# EAGLE design X13_Power_Distribution_D (EAGLE 9.6.2)
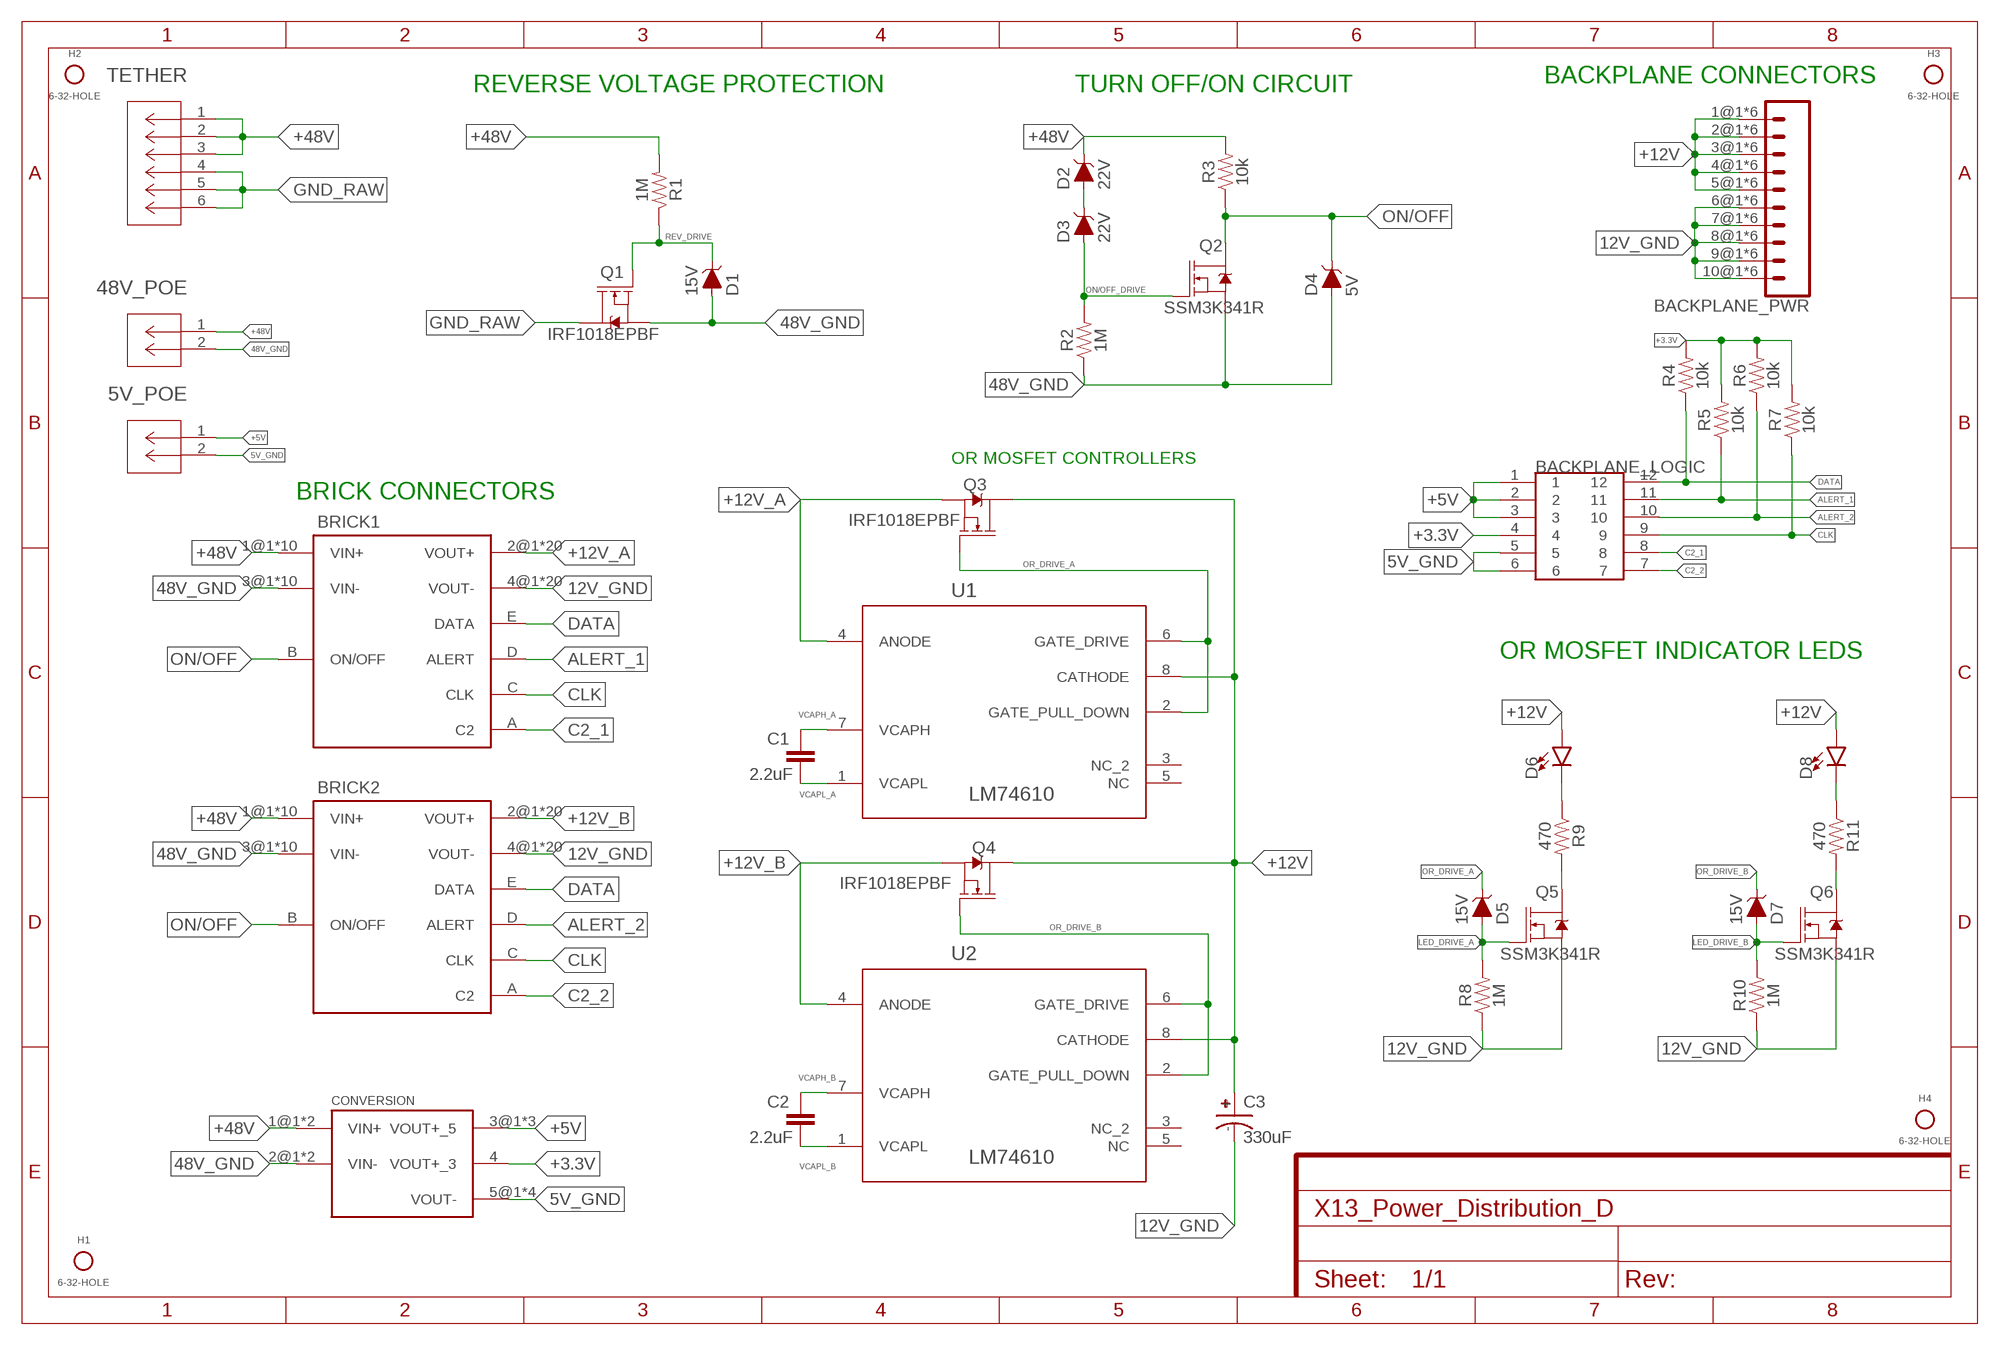
[diagram p0: schematic, sheet 1, part 1 of 2]
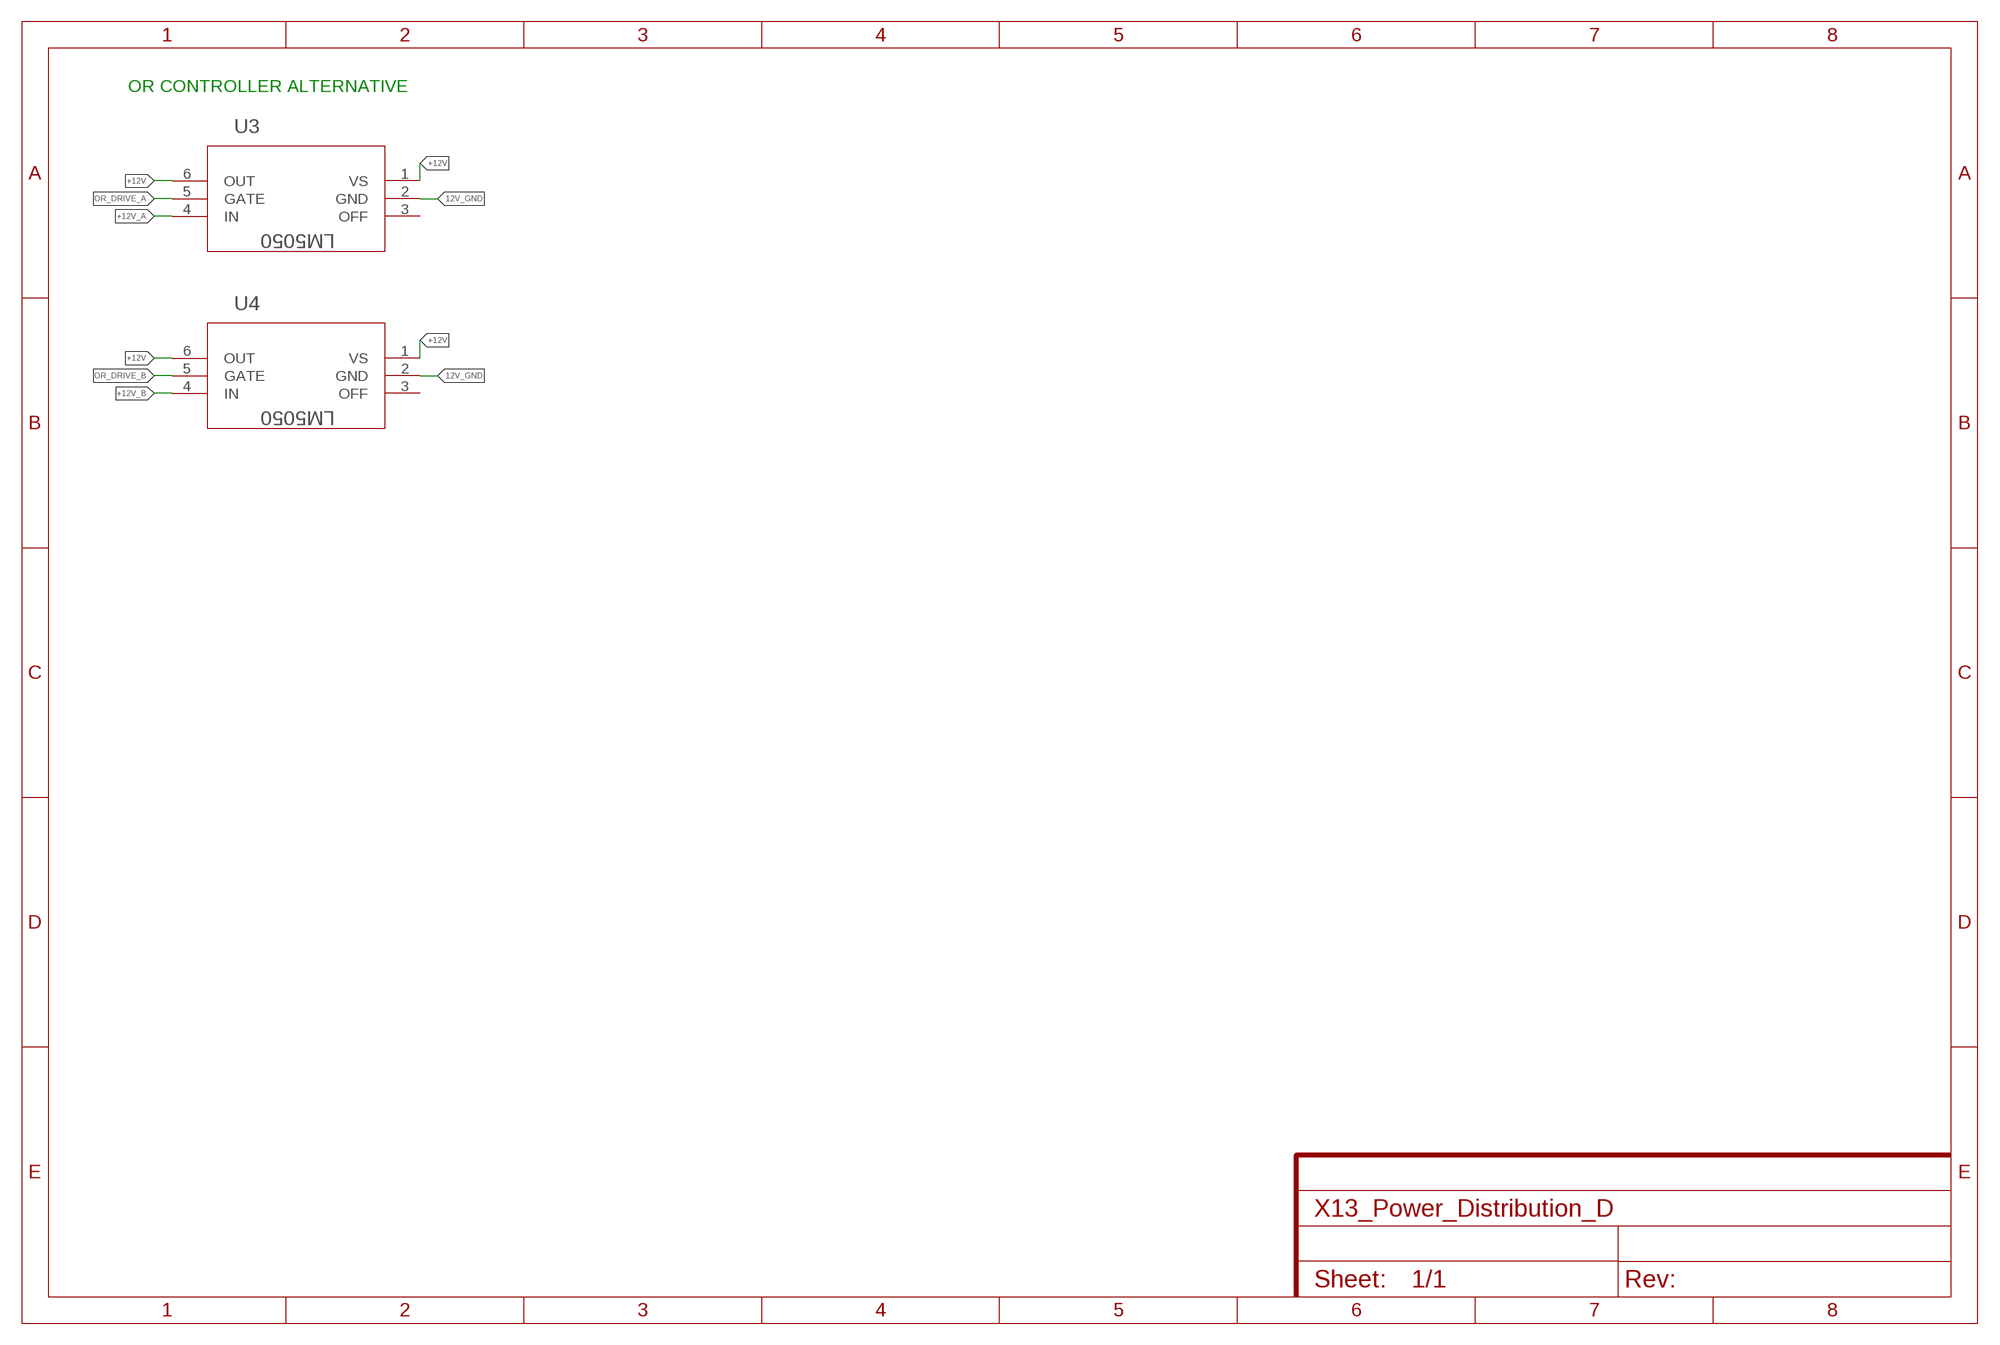
[diagram p1: schematic, sheet 1, part 2 of 2]

## Parts
5V_POE  POE_TERMINAL  [CONN2_282834-2_TEC]
48V_POE  POE_TERMINAL  [CONN2_282834-2_TEC]
BACKPLANE_LOGIC  IPL1-106-01-L-D-K  [IPL1-106-01-L-D-K]
BACKPLANE_PWR  MPPT-10-01-01-L-RA-SD  [MPPT-10-01-01-L-RA-SD]
BRICK1  DIST2BRICKVER_D2  [DIST2BRICK_D2]
BRICK2  DIST2BRICKVER_D2  [DIST2BRICK_D2]
C1  2.2uF  0.1UF-0603-100V-10%  [0603]
C2  2.2uF  0.1UF-0603-100V-10%  [0603]
C3  330uF  UCM1H331MNL1GS  [CAPAE1030X1050N]
CONVERSION  DIST2CON  [DIST2CON]
D1  15V  DIODE-ZENER-BZT52C3V6S  [SOD-323]
D2  22V  DIODE-ZENER-BZT52C3V6S  [SOD-323]
D3  22V  DIODE-ZENER-BZT52C3V6S  [SOD-323]
D4  5V  DIODE-ZENER-BZT52C3V6S  [SOD-323]
D5  15V  DIODE-ZENER-BZT52C3V6S  [SOD-323]
D6  LED0603  [LED-0603]
D7  15V  DIODE-ZENER-BZT52C3V6S  [SOD-323]
D8  LED0603  [LED-0603]
H1  6-32-HOLE  [6-32-HOLE]
H2  6-32-HOLE  [6-32-HOLE]
H3  6-32-HOLE  [6-32-HOLE]
H4  6-32-HOLE  [6-32-HOLE]
Q1  IRF1018EPBF  [TO263]
Q2  SSM3K341R  MOSFET-NCH-2N7002PW  [SOT323]
Q3  IRF1018EPBF  [TO263]
Q4  IRF1018EPBF  [TO263]
Q5  SSM3K341R  MOSFET-NCH-2N7002PW  [SOT323]
Q6  SSM3K341R  MOSFET-NCH-2N7002PW  [SOT323]
R1  1M  RESISTOR0603  [0603]
R2  1M  RESISTOR0603  [0603]
R3  10k  RESISTOR0603  [0603]
R4  10k  RESISTOR0603  [0603]
R5  10k  RESISTOR0603  [0603]
R6  10k  RESISTOR0603  [0603]
R7  10k  RESISTOR0603  [0603]
R8  1M  RESISTOR0603  [0603]
R9  470  RESISTOR0603  [0603]
R10  1M  RESISTOR0603  [0603]
R11  470  RESISTOR0603  [0603]
TETHER  48V  DIST_TO_TETHER  [CON6_P5MM_VER_TERM-BLK_TYC]
U1  LM74610  DIST_OR_DIODEDGK0008A_M  [DGK0008A_M]
U2  LM74610  DIST_OR_DIODEDGK0008A_M  [DGK0008A_M]
U3  LM5050  DIST_OR_CONTROL_ALTMK06A-M  [MK06A-M]
U4  LM5050  DIST_OR_CONTROL_ALTMK06A-M  [MK06A-M]

## Nets
5V_GND: 5V_POE.2 BACKPLANE_LOGIC.5 BACKPLANE_LOGIC.6 CONVERSION.5@1(VOUT-) CONVERSION.5@2(VOUT-) CONVERSION.5@3(VOUT-) CONVERSION.5@4(VOUT-)
12V_GND: BACKPLANE_PWR.6@1 BACKPLANE_PWR.6@2 BACKPLANE_PWR.6@3 BACKPLANE_PWR.6@4 BACKPLANE_PWR.6@5 BACKPLANE_PWR.6@6 BACKPLANE_PWR.7@1 BACKPLANE_PWR.7@2 BACKPLANE_PWR.7@3 BACKPLANE_PWR.7@4 BACKPLANE_PWR.7@5 BACKPLANE_PWR.7@6 BACKPLANE_PWR.8@1 BACKPLANE_PWR.8@2 BACKPLANE_PWR.8@3 BACKPLANE_PWR.8@4 BACKPLANE_PWR.8@5 BACKPLANE_PWR.8@6 BACKPLANE_PWR.9@1 BACKPLANE_PWR.9@2 BACKPLANE_PWR.9@3 BACKPLANE_PWR.9@4 BACKPLANE_PWR.9@5 BACKPLANE_PWR.9@6 BACKPLANE_PWR.10@1 BACKPLANE_PWR.10@2 BACKPLANE_PWR.10@3 BACKPLANE_PWR.10@4 BACKPLANE_PWR.10@5 BACKPLANE_PWR.10@6 BRICK1.4@1(VOUT-) BRICK1.4@2(VOUT-) BRICK1.4@3(VOUT-) BRICK1.4@4(VOUT-) BRICK1.4@5(VOUT-) BRICK1.4@6(VOUT-) BRICK1.4@7(VOUT-) BRICK1.4@8(VOUT-) BRICK1.4@9(VOUT-) BRICK1.4@10(VOUT-) BRICK1.4@11(VOUT-) BRICK1.4@12(VOUT-) BRICK1.4@13(VOUT-) BRICK1.4@14(VOUT-) BRICK1.4@15(VOUT-) BRICK1.4@16(VOUT-) BRICK1.4@17(VOUT-) BRICK1.4@18(VOUT-) BRICK1.4@19(VOUT-) BRICK1.4@20(VOUT-) BRICK2.4@1(VOUT-) BRICK2.4@2(VOUT-) BRICK2.4@3(VOUT-) BRICK2.4@4(VOUT-) BRICK2.4@5(VOUT-) BRICK2.4@6(VOUT-) BRICK2.4@7(VOUT-) BRICK2.4@8(VOUT-) BRICK2.4@9(VOUT-) BRICK2.4@10(VOUT-) BRICK2.4@11(VOUT-) BRICK2.4@12(VOUT-) BRICK2.4@13(VOUT-) BRICK2.4@14(VOUT-) BRICK2.4@15(VOUT-) BRICK2.4@16(VOUT-) BRICK2.4@17(VOUT-) BRICK2.4@18(VOUT-) BRICK2.4@19(VOUT-) BRICK2.4@20(VOUT-) C3.- Q5.2(S) Q6.2(S) R8.1 R10.1 U3.2(GND) U4.2(GND)
48V_GND: 48V_POE.2 BRICK1.3@1(VIN-) BRICK1.3@2(VIN-) BRICK1.3@3(VIN-) BRICK1.3@4(VIN-) BRICK1.3@5(VIN-) BRICK1.3@6(VIN-) BRICK1.3@7(VIN-) BRICK1.3@8(VIN-) BRICK1.3@9(VIN-) BRICK1.3@10(VIN-) BRICK2.3@1(VIN-) BRICK2.3@2(VIN-) BRICK2.3@3(VIN-) BRICK2.3@4(VIN-) BRICK2.3@5(VIN-) BRICK2.3@6(VIN-) BRICK2.3@7(VIN-) BRICK2.3@8(VIN-) BRICK2.3@9(VIN-) BRICK2.3@10(VIN-) CONVERSION.2@1(VIN-) CONVERSION.2@2(VIN-) D1.A D4.A Q1.2(S) Q2.2(S) R2.1
+3.3V: BACKPLANE_LOGIC.4 CONVERSION.4(VOUT+_3) R4.2 R5.2 R6.2 R7.2
+5V: 5V_POE.1 BACKPLANE_LOGIC.1 BACKPLANE_LOGIC.2 BACKPLANE_LOGIC.3 CONVERSION.3@1(VOUT+_5) CONVERSION.3@2(VOUT+_5) CONVERSION.3@3(VOUT+_5)
+12V: BACKPLANE_PWR.1@1 BACKPLANE_PWR.1@2 BACKPLANE_PWR.1@3 BACKPLANE_PWR.1@4 BACKPLANE_PWR.1@5 BACKPLANE_PWR.1@6 BACKPLANE_PWR.2@1 BACKPLANE_PWR.2@2 BACKPLANE_PWR.2@3 BACKPLANE_PWR.2@4 BACKPLANE_PWR.2@5 BACKPLANE_PWR.2@6 BACKPLANE_PWR.3@1 BACKPLANE_PWR.3@2 BACKPLANE_PWR.3@3 BACKPLANE_PWR.3@4 BACKPLANE_PWR.3@5 BACKPLANE_PWR.3@6 BACKPLANE_PWR.4@1 BACKPLANE_PWR.4@2 BACKPLANE_PWR.4@3 BACKPLANE_PWR.4@4 BACKPLANE_PWR.4@5 BACKPLANE_PWR.4@6 BACKPLANE_PWR.5@1 BACKPLANE_PWR.5@2 BACKPLANE_PWR.5@3 BACKPLANE_PWR.5@4 BACKPLANE_PWR.5@5 BACKPLANE_PWR.5@6 C3.+ D6.A D8.A Q3.3(D) Q4.3(D) U1.8(CATHODE) U2.8(CATHODE) U3.1(VS) U3.6(OUT) U4.1(VS) U4.6(OUT)
+12V_A: BRICK1.2@1(VOUT+) BRICK1.2@2(VOUT+) BRICK1.2@3(VOUT+) BRICK1.2@4(VOUT+) BRICK1.2@5(VOUT+) BRICK1.2@6(VOUT+) BRICK1.2@7(VOUT+) BRICK1.2@8(VOUT+) BRICK1.2@9(VOUT+) BRICK1.2@10(VOUT+) BRICK1.2@11(VOUT+) BRICK1.2@12(VOUT+) BRICK1.2@13(VOUT+) BRICK1.2@14(VOUT+) BRICK1.2@15(VOUT+) BRICK1.2@16(VOUT+) BRICK1.2@17(VOUT+) BRICK1.2@18(VOUT+) BRICK1.2@19(VOUT+) BRICK1.2@20(VOUT+) Q3.2(S) U1.4(ANODE) U3.4(IN)
+12V_B: BRICK2.2@1(VOUT+) BRICK2.2@2(VOUT+) BRICK2.2@3(VOUT+) BRICK2.2@4(VOUT+) BRICK2.2@5(VOUT+) BRICK2.2@6(VOUT+) BRICK2.2@7(VOUT+) BRICK2.2@8(VOUT+) BRICK2.2@9(VOUT+) BRICK2.2@10(VOUT+) BRICK2.2@11(VOUT+) BRICK2.2@12(VOUT+) BRICK2.2@13(VOUT+) BRICK2.2@14(VOUT+) BRICK2.2@15(VOUT+) BRICK2.2@16(VOUT+) BRICK2.2@17(VOUT+) BRICK2.2@18(VOUT+) BRICK2.2@19(VOUT+) BRICK2.2@20(VOUT+) Q4.2(S) U2.4(ANODE) U4.4(IN)
+48V: 48V_POE.1 BRICK1.1@1(VIN+) BRICK1.1@2(VIN+) BRICK1.1@3(VIN+) BRICK1.1@4(VIN+) BRICK1.1@5(VIN+) BRICK1.1@6(VIN+) BRICK1.1@7(VIN+) BRICK1.1@8(VIN+) BRICK1.1@9(VIN+) BRICK1.1@10(VIN+) BRICK2.1@1(VIN+) BRICK2.1@2(VIN+) BRICK2.1@3(VIN+) BRICK2.1@4(VIN+) BRICK2.1@5(VIN+) BRICK2.1@6(VIN+) BRICK2.1@7(VIN+) BRICK2.1@8(VIN+) BRICK2.1@9(VIN+) BRICK2.1@10(VIN+) CONVERSION.1@1(VIN+) CONVERSION.1@2(VIN+) D2.C R1.2 R3.2 TETHER.1 TETHER.2 TETHER.3
ALERT_1: BACKPLANE_LOGIC.11 BRICK1.D(ALERT) R5.1
ALERT_2: BACKPLANE_LOGIC.10 BRICK2.D(ALERT) R6.1
C2_1: BACKPLANE_LOGIC.8 BRICK1.A(C2)
C2_2: BACKPLANE_LOGIC.7 BRICK2.A(C2)
CLK: BACKPLANE_LOGIC.9 BRICK1.C(CLK) BRICK2.C(CLK) R7.1
DATA: BACKPLANE_LOGIC.12 BRICK1.E(DATA) BRICK2.E(DATA) R4.1
GND_RAW: Q1.3(D) TETHER.4 TETHER.5 TETHER.6
LED_DRIVE_A: D5.A Q5.1(G) R8.2
LED_DRIVE_B: D7.A Q6.1(G) R10.2
N$1: D2.A D3.C
N$4: Q5.3(D) R9.2
N$5: D6.C R9.1
N$6: Q6.3(D) R11.2
N$7: D8.C R11.1
ON/OFF: BRICK1.B(ON/OFF) BRICK2.B(ON/OFF) D4.C Q2.3(D) R3.1
ON/OFF_DRIVE: D3.A Q2.1(G) R2.2
OR_DRIVE_A: D5.C Q3.1(G) U1.2(GATE_PULL_DOWN) U1.6(GATE_DRIVE) U3.5(GATE)
OR_DRIVE_B: D7.C Q4.1(G) U2.2(GATE_PULL_DOWN) U2.6(GATE_DRIVE) U4.5(GATE)
REV_DRIVE: D1.C Q1.1(G) R1.1
VCAPH_A: C1.1 U1.7(VCAPH)
VCAPH_B: C2.1 U2.7(VCAPH)
VCAPL_A: C1.2 U1.1(VCAPL)
VCAPL_B: C2.2 U2.1(VCAPL)
Unconnected: U1.3(NC_2) U1.5(NC) U2.3(NC_2) U2.5(NC) U3.3(OFF) U4.3(OFF)

## Notes on the sheet
- BACKPLANE CONNECTORS
- REVERSE VOLTAGE PROTECTION | TURN OFF/ON CIRCUIT | OR CONTROLLER ALTERNATIVE
- OR MOSFET CONTROLLERS
- BRICK CONNECTORS
- OR MOSFET INDICATOR LEDS

## Library data of the parts
5V_POE 48V_POE = Dist_POE:POE_TERMINAL; BUILT_BY: EMA_UL_Team; COPYRIGHT: Copyright (C) 2016 Accelerated Designs. All rights reserved; DESCRIPTION: TERMI-BLOK PCB MOUNT, 90 2P.; MANUFACTURER_PART_NUMBER: 282834-2; PITCH_MM_: 2.54; POSITIONS: 2; PRODUCT: Terminal Block Headers & Receptacles; ROWS-CONFIG: 1; SOURCELIBRARY: TE_Connectivity-2018-03-16; TE_PART_NUMBER: 282834-2; TYPE: Receptacle; VENDOR: TE Connectivity
BACKPLANE_LOGIC = Backplane_Dist_Logic_Connector:IPL1-106-01-L-D-K
BACKPLANE_PWR = Samtec MPPT Hermaphoditic 10 pos - MPPT-10-01-01-L-RA-SD:MPPT-10-01-01-L-RA-SD: Samtec MPPT Connector Right Angle Vertically mating Non-gendered https://www.samtec.com/products/mppt-10-01-01-l-ra-sd
BRICK1 BRICK2 = Brick_Dist_Connector:DIST2BRICK
C1 C2 = SparkFun-Capacitors:0.1UF: 0.1µF ceramic capacitors A capacitor is a passive two-terminal electrical component used to store electrical energy temporarily in an electric field.; PROD_ID: CAP-08390; VALUE: 0.1uF
C3 = brick-capacitor-UCM1H331MNL1GS:UCM1H331MNL1GS: Nichicon 330uF 50 V Aluminium Electrolytic Capacitor SMD, CM Series 2000h 10 (Dia.) x 10mm Source: Datasheet <http://www.nichicon.co.jp/english/products/pdfs/e-ucm.pdf>; ARROW_PART_NUMBER: UCM1H331MNL1GS; ARROW_PRICE-STOCK: https://www.arrow.com/en/products/ucm1h331mnl1gs/nichicon; DESCRIPTION: Nichicon 330uF 50 V Aluminium Electrolytic Capacitor SMD, CM Series 2000h 10 (Dia.) x 10mm; HEIGHT: 10.5mm; MANUFACTURER_NAME: Nichicon; MANUFACTURER_PART_NUMBER: UCM1H331MNL1GS; MOUSER_PART_NUMBER: 647-UCM1H331MNL1GS; MOUSER_PRICE-STOCK: https://www.mouser.co.uk/ProductDetail/Nichicon/UCM1H331MNL1GS?qs=DSgADHjnLTkTovFLdbC%252BNg%3D%3D
CONVERSION = Dist_Convert_Connector:DIST2CON
D1-D5 D7 = SparkFun-DiscreteSemi:DIODE-ZENER: Zener Diode A Zener diode allows current to flow from its anode to its cathode like a normal semiconductor diode, but it also permits current to flow in the reverse direction when its "Zener voltage" is reached. - WIkipedia; PROD_ID: DIO-08199; VALUE: 3.6V
D6 D8 = SparkFun-LED:LED: LED (Generic) Standard schematic elements and footprints for 5mm, 3mm, 1206, and 0603 sized LEDs. Generic LEDs with no color specified.
H1-H4 = Mounting Holes:6-32-HOLE
Q1 Q3 Q4 = Reverse_Voltage_NMOS:IRF1018EPBF
Q2 Q5 Q6 = SparkFun-DiscreteSemi:MOSFET-NCH: N-channel MOSFETs Voltage controlled devices that allow control of high current outputs. SparkFun Products: SparkFun OpenScale <https://www.sparkfun.com/products/13261> SparkFun Digital Sandbox <https://www.sparkfun.com/products/12651> SparkFun Monster Moto Shield <https://www.sparkfun.com/products/10182> SparkFun MOSFET Power Controller <https://www.sparkfun.com/products/11214>; PROD_ID: TRANS-11151; VALUE: 310mA/60V/1.6Ω
R1 R4-R7 R9 R11 = SparkFun-Resistors:RESISTOR: Generic Resistor Package
R2 R3 R8 R10 = SparkFun-Resistors:RESISTOR: Generic Resistor Package; SPICEPREFIX: R
TETHER = Dist_To_Tether_Connector:DIST_TO_TETHER; BUILT_BY: EMA_UL_Team; MANUFACTURER_PART_NUMBER: 796636-6; SOURCELIBRARY: Tyco_2012-04-26; VENDOR: TE Connectivity
U1 U2 = Dist_OR_Controller:DIST_OR_DIODE; APPLICATION_BUILDNUMBER: *; COMPTYPE: IC; MANUFACTURER: Texas Instruments; MOUNTTYPE: SMT; PACKAGEREFERENCE: DGK0008A; PARTNUMBER: LM74610QDGKRQ1; PIN_COUNT: 8; REFDES: RefDes; TYPE: TYPE; VALUE: Value
U3 U4 = Dist_OR_Controller:DIST_OR_CONTROL_ALT; BASEPN: LM5050-1; DATASHEETURL: http://www.ti.com/lit/ds/symlink/lm5050-1.pdf; DESCRIPTION: High Side OR-ing FET Controller; MANUFACTURER: Texas Instruments; MANUFACTURER_PART_NUMBER: LM5050MK-1/NOPB; NSC_PACKAGEREFERENCE: MK06A; VENDOR: Texas Instruments

## Net classes
0 default: width 0.203 mm, clearance 0.205 mm

## Board
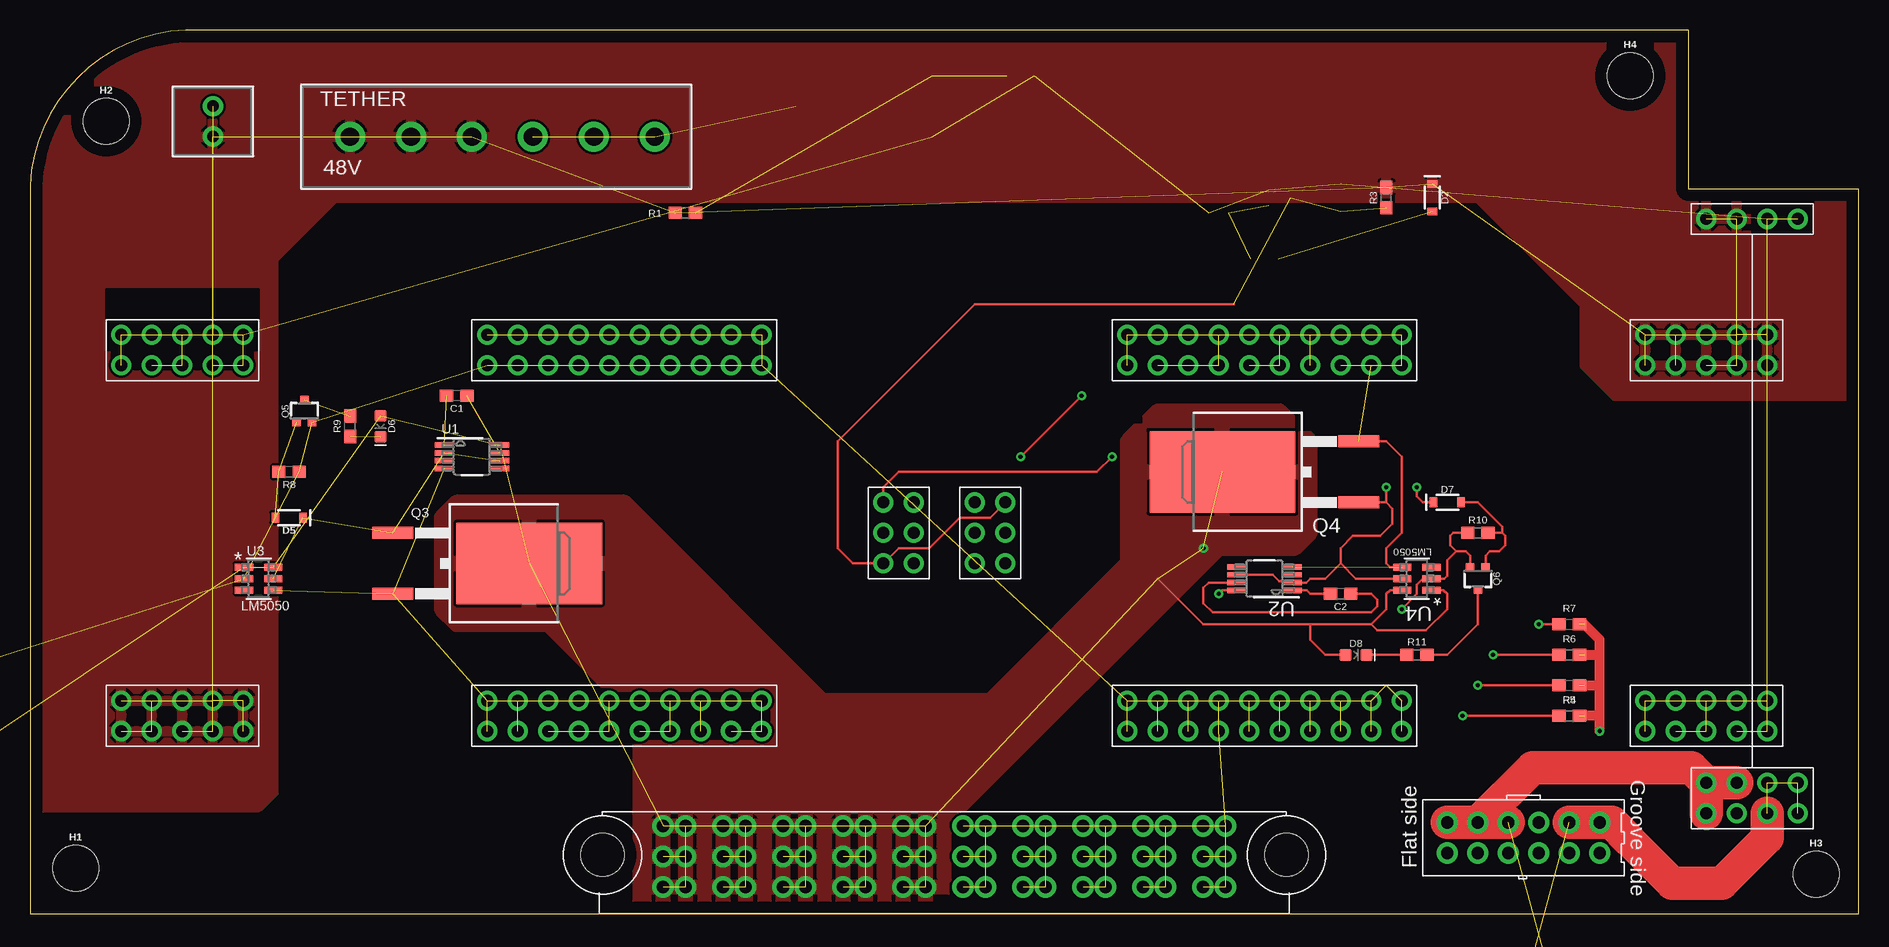
[diagram p2: board, top side]
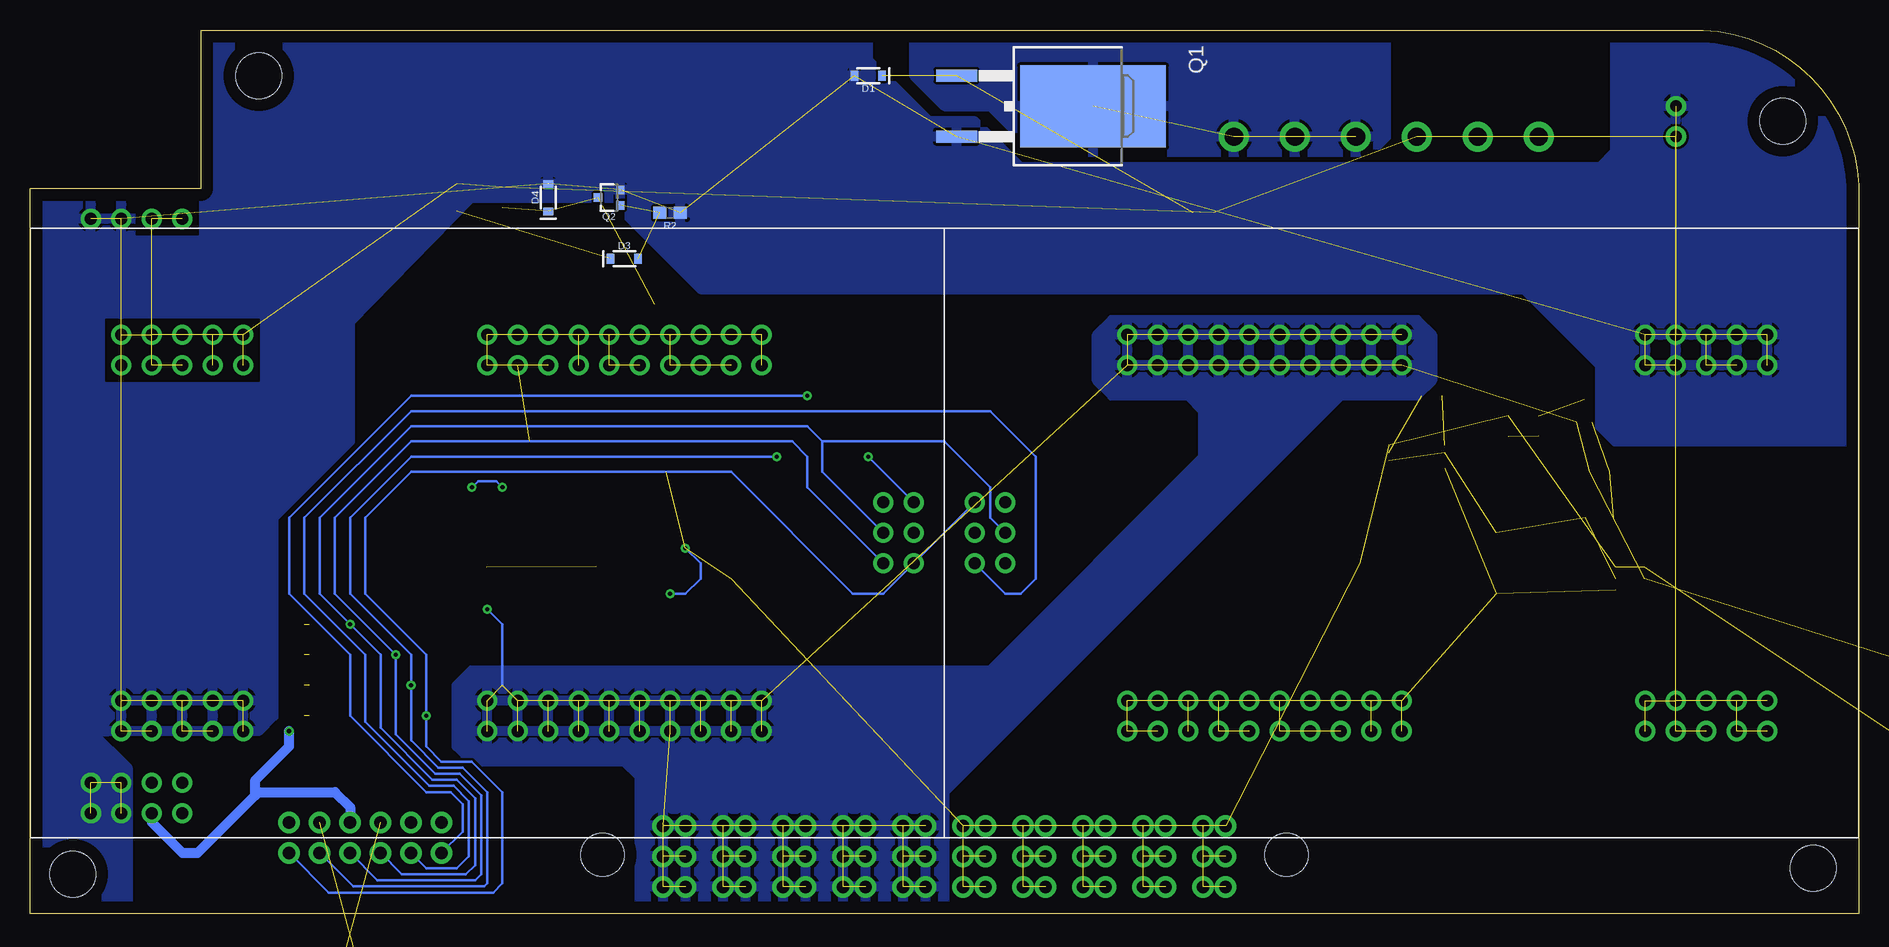
[diagram p3: board, bottom side, seen from below]

Size 152.4 x 73.66 mm. Coordinates in mm from the lower left corner, seen from the top.
Outline: 0,0 152.4,0 152.4,60.45 138.18,60.45 138.18,73.66 14.22,73.66 arc90 0,60.71 0,0
Copper layers (1*16): Top 0.035mm / dielectric 1.5mm / Bottom 0.035mm
Design rules "default": minimum track width 6mil, minimum drill 0.35mm, track to track 6mil, track to pad 6mil, pad to pad 6mil, via to via 6mil, smd to smd 6mil, copper to edge 40mil, drill to drill 6mil, minimum pad ring 10mil, minimum via ring 8mil, stop-mask expansion 4mil, vias tented up to drill 0mil, thermal gap 10mil

### Footprints (pad centres in the part's own frame; a part is rotated, then mirrored left to right if it is on the bottom)
CONN2_282834-2_TEC = drill 0.965 pad 1.7: 1 0,0; 2 2.54,0
IPL1-106-01-L-D-K = drill 1.016 pad 1.778: 1 0,0; 2 2.54,0; 3 5.08,0; 4 7.62,0; 5 10.16,0; 6 12.7,0; 7 0,-2.54; 8 2.54,-2.54; 9 5.08,-2.54; 10 7.62,-2.54; 11 10.16,-2.54; 12 12.7,-2.54
MPPT-10-01-01-L-RA-SD = drill 1.04 pad 1.8: 1@1 -23.44,2.26; 1@2 -21.56,2.26; 1@3 -23.44,4.8; 1@4 -21.56,4.8; 1@5 -23.44,7.34; 1@6 -21.56,7.34; 2@1 -18.44,2.26; 2@2 -16.56,2.26; 2@3 -18.44,4.8; 2@4 -16.56,4.8; 2@5 -18.44,7.34; 2@6 -16.56,7.34; 3@1 -13.44,2.26; 3@2 -11.56,2.26; 3@3 -13.44,4.8; 3@4 -11.56,4.8; 3@5 -13.44,7.34; 3@6 -11.56,7.34; 4@1 -8.44,2.26; 4@2 -6.56,2.26; 4@3 -8.44,4.8; 4@4 -6.56,4.8; 4@5 -8.44,7.34; 4@6 -6.56,7.34; 5@1 -3.44,2.26; 5@2 -1.56,2.26; 5@3 -3.44,4.8; 5@4 -1.56,4.8; 5@5 -3.44,7.34; 5@6 -1.56,7.34; 6@1 1.56,2.26; 6@2 3.44,2.26; 6@3 1.56,4.8; 6@4 3.44,4.8; 6@5 1.56,7.34; 6@6 3.44,7.34; 7@1 6.56,2.26; 7@2 8.44,2.26; 7@3 6.56,4.8; 7@4 8.44,4.8; 7@5 6.56,7.34; 7@6 8.44,7.34; 8@1 11.56,2.26; 8@2 13.44,2.26; 8@3 11.56,4.8; 8@4 13.44,4.8; 8@5 11.56,7.34; 8@6 13.44,7.34; 9@1 16.56,2.26; 9@2 18.44,2.26; 9@3 16.56,4.8; 9@4 18.44,4.8; 9@5 16.56,7.34; 9@6 18.44,7.34; 10@1 21.56,2.26; 10@2 23.44,2.26; 10@3 21.56,4.8; 10@4 23.44,4.8; 10@5 21.56,7.34; 10@6 23.44,7.34 | hole 3.6: 28.5,4.93; -28.5,4.93
DIST2BRICK_D2 = drill 1 pad 1.676: 1@1 -30.48,-16.51; 1@2 -30.48,-13.97; 1@3 -27.94,-16.51; 1@4 -27.94,-13.97; 1@5 -25.4,-16.51; 1@6 -25.4,-13.97; 1@7 -22.86,-16.51; 1@8 -22.86,-13.97; 1@9 -20.32,-16.51; 1@10 -20.32,-13.97; 2@1 0,-16.51; 2@2 0,-13.97; 2@3 2.54,-16.51; 2@4 2.54,-13.97; 2@5 5.08,-16.51; 2@6 5.08,-13.97; 2@7 7.62,-16.51; 2@8 7.62,-13.97; 2@9 10.16,-16.51; 2@10 10.16,-13.97; 2@11 12.7,-16.51; 2@12 12.7,-13.97; 2@13 15.24,-16.51; 2@14 15.24,-13.97; 2@15 17.78,-16.51; 2@16 17.78,-13.97; 2@17 20.32,-13.97; 2@18 22.86,-13.97; 2@19 22.86,-16.51; 2@20 20.32,-16.51; 3@1 -30.48,13.97; 3@2 -30.48,16.51; 3@3 -27.94,13.97; 3@4 -27.94,16.51; 3@5 -25.4,13.97; 3@6 -25.4,16.51; 3@7 -22.86,13.97; 3@8 -22.86,16.51; 3@9 -20.32,13.97; 3@10 -20.32,16.51; 4@1 0,13.97; 4@2 0,16.51; 4@3 2.54,13.97; 4@4 2.54,16.51; 4@5 5.08,13.97; 4@6 5.08,16.51; 4@7 7.62,13.97; 4@8 7.62,16.51; 4@9 10.16,13.97; 4@10 10.16,16.51; 4@11 12.7,13.97; 4@12 12.7,16.51; 4@13 15.24,13.97; 4@14 15.24,16.51; 4@15 17.78,13.97; 4@16 17.78,16.51; 4@17 20.32,16.51; 4@18 22.86,16.51; 4@19 22.86,13.97; 4@20 20.32,13.97; A 35.56,-2.54; B 33.02,-2.54; C 33.02,0; D 33.02,2.54; E 35.56,2.54; F 35.56,0
0603 = smd 1.1 x 1: 1 -0.85,0; 2 0.85,0
CAPAE1030X1050N = smd 4.3 x 2.15: + -4.2,0; - 4.2,0
DIST2CON = drill 1 pad 1.676: 1@1 -3.81,22.86; 1@2 -1.27,22.86; 2@1 1.27,22.86; 2@2 3.81,22.86; 3@1 -3.81,-26.67; 3@2 -3.81,-24.13; 3@3 -1.27,-24.13; 4 -1.27,-26.67; 5@1 1.27,-26.67; 5@2 1.27,-24.13; 5@3 3.81,-26.67; 5@4 3.81,-24.13
SOD-323 = smd 0.63 x 0.83: A 1.15,0; C -1.15,0
LED-0603 = smd 1 x 1: A -0.877,0; C 0.877,0
6-32-HOLE = hole 3.81: 0,0
TO263 = smd 1 x 3.4: 1 -2.54,-6.6; 2 2.54,-6.6 | smd 6.8 x 12.14: 3 0,4.77
SOT323 = smd 0.7 x 0.7: 1 -0.65,-0.925; 2 0.65,-0.925; 3 0,0.925
CON6_P5MM_VER_TERM-BLK_TYC = drill 1.524 pad 2.5: 1 0,0; 2 5.08,0; 3 10.16,0; 4 15.24,0; 5 20.32,0; 6 25.4,0
DGK0008A_M = smd 1.55 x 0.45: 1 -2.325,0.975; 2 -2.325,0.325; 3 -2.325,-0.325; 4 -2.325,-0.975; 5 2.325,-0.975; 6 2.325,-0.325; 7 2.325,0.325; 8 2.325,0.975
MK06A-M = smd 1.524 x 0.584: 1 -1.219,0.95; 2 -1.219,0; 3 -1.219,-0.95; 4 1.219,-0.95; 5 1.219,0; 6 1.219,0.95

### Placement (x,y rotation side)
5V_POE  127,-6.35 180 top  (outside the outline)
48V_POE  15.24,64.77 90 top
BACKPLANE_LOGIC  118.11,7.62 0 top
BACKPLANE_PWR  76.2,0 0 top
BRICK1  38.1,31.75 0 top
BRICK2  114.3,31.75 180 top
C1  35.56,43.18 180 top
C2  109.22,26.67 180 top
C3  -8.89,15.24 90 top  (outside the outline)
CONVERSION  143.51,35.05 0 top
D1  82.55,69.85 180 bottom
D2  116.84,59.69 270 top
D3  102.87,54.61 0 bottom
D4  109.22,59.69 90 bottom
D5  21.59,33.02 180 top
D6  29.21,40.64 270 top
D7  118.11,34.29 0 top
D8  110.49,21.59 0 top
H1  3.81,3.81 0 top
H2  6.35,66.04 0 top
H3  148.84,3.3 0 top
H4  133.35,69.85 0 top
Q1  68.58,67.31 270 bottom
Q2  104.14,59.69 90 bottom
Q3  36.83,29.21 270 top
Q4  104.14,36.83 90 top
Q5  22.86,41.91 0 top
Q6  120.65,27.94 180 top
R1  54.61,58.42 180 top
R2  99.06,58.42 180 bottom
R3  113.03,59.69 90 top
R4  128.27,16.51 0 top
R5  128.27,19.05 0 top
R6  128.27,21.59 0 top
R7  128.27,24.13 0 top
R8  21.59,36.83 180 top
R9  26.67,40.64 90 top
R10  120.65,31.75 0 top
R11  115.57,21.59 0 top
TETHER  26.67,64.77 0 top
U1  36.83,38.1 0 top
U2  102.87,27.94 180 top
U3  19.05,27.94 0 top
U4  115.57,27.94 180 top

### Tracks (layer width: path | path; a pad name or v marks a point on that pad's centre or on a via)
5V_GND  (4 unrouted)
  Top 2.794: CONVERSION.5@1 144.78,6.35 140.97,2.54 136.86,2.54 133.3,6.1 133.3,6.11 131.79,7.62 BACKPLANE_LOGIC.6 BACKPLANE_LOGIC.5
  pour Bottom (no thermals): 144.27,12.19 144.27,-0.76 147.32,-3.81 151.13,-3.81 156.21,1.27 156.21,25.4 153.67,27.94 148.59,27.94 147.32,26.67 147.32,15.24
12V_GND  (via drill 0.35)  (74 unrouted)
  Top 0.203: Q6.2 120,29.86 119.63,30.23 118.87,30.23 | 118.87,30.23 118.36,30.73 118.36,31.5 118.62,31.75 R10.1 | 118.87,30.23 118.11,29.46 118.11,28.19 117.86,27.94 U4.2 116.08,27.94 115.57,27.43 115.57,26.67 v114.3,25.4
  Bottom 0.203: v114.3,25.4 113.03,24.13 113.03,19.05
  pour Bottom: 76.2,-5.08 101.6,-5.08 101.6,11.43 102.87,12.7 115.57,12.7 116.84,13.97 116.84,19.05 115.57,20.32 72.39,20.32 54.61,38.1 54.61,41.91 55.88,43.18 62.23,43.18 63.5,44.45 63.5,48.26 62.23,49.53 36.83,49.53 35.56,48.26 35.56,44.45 36.83,43.18 43.18,43.18 76.2,10.16
48V_GND  (27 unrouted)
  pour Bottom: 27.94,52.07 21.59,45.72 21.59,40.64 20.32,39.37 -3.81,39.37 -3.81,67.31 6.35,77.47 17.78,77.47 20.32,74.93 20.32,63.5 21.59,62.23 69.85,62.23 73.66,66.04 77.47,66.04 82.55,71.12 82.55,76.2 83.82,77.47 144.78,77.47 156.21,66.04 156.21,22.86 148.59,15.24 133.35,15.24 132.08,16.51 132.08,33.02 125.73,39.37 125.73,49.33 115.63,59.69 104.14,59.69 96.52,52.07
  cutout Bottom: 133.35,49.53 146.05,49.53 146.05,44.45 133.35,44.45
  cutout Bottom: 138.43,59.18 138.43,56.64 143.51,56.64 143.51,59.18
+3.3V  (via drill 0.35)  (4 unrouted)
  Top 0.813: v130.81,15.24 130.81,16.51 | 130.81,16.51 129.54,16.51 | 129.54,19.05 130.81,19.05 | 130.81,16.51 130.81,19.05 | 130.81,19.05 130.81,21.59 | 129.54,21.59 130.81,21.59 | 130.81,21.59 130.81,22.86 129.54,24.13
  Bottom 0.813: 133.63,9.88 133.63,11.15 130.81,13.97 v130.81,15.24 | CONVERSION.4 142.24,7.62 139.7,5.08 138.43,5.08 133.63,9.88 | 133.63,9.88 133.35,10.16 127,10.16 125.73,8.89 BACKPLANE_LOGIC.4
+5V  (1 unrouted)
  Top 2.794: CONVERSION.3@1 CONVERSION.3@2 | CONVERSION.3@3 CONVERSION.3@2 | CONVERSION.3@2 138.43,12.19 125.22,12.19 BACKPLANE_LOGIC.2 | BACKPLANE_LOGIC.2 BACKPLANE_LOGIC.3 | BACKPLANE_LOGIC.2 BACKPLANE_LOGIC.1
+12V  (via drill 0.35)  (38 unrouted)
  Top 0.203: U2.8 99.36,26.96 v99.06,26.67 | 111.76,24.13 106.68,24.13 | 106.68,24.13 97.79,24.13 93.98,27.94 | U4.6 113.35,26.99 113.03,26.67 113.03,25.4 111.76,24.13 | U4.1 117.79,26.99 118.11,26.67 118.11,25.4 116.33,23.62 112.27,23.62 111.76,24.13 | D8.A 107.95,21.59 106.68,22.86 106.68,24.13
  Bottom 0.203: v99.06,26.67 97.79,26.67 96.52,27.94 96.52,29.21 v97.79,30.48
  pour Top: 34.29,25.4 35.56,24.13 43.18,24.13 50.8,16.51 50.8,-5.08 76.2,-5.08 76.2,7.62 99.06,30.48 105.41,30.48 106.68,31.75 106.68,39.37 104.14,41.91 93.98,41.91 91.44,39.37 91.44,29.21 80.01,17.78 66.04,17.78 49.53,34.29 35.56,34.29 34.29,33.02
+12V_A  (22 unrouted)
+12V_B  (21 unrouted)
  Top 0.203: Q4.2 113.03,39.37 114.3,38.1 114.3,31.75 113.03,30.48 113.03,29.21 113.35,28.89 U4.4
+48V  (28 unrouted)
  pour Top: 19.05,8.89 20.32,10.16 20.32,54.61 25.4,59.69 120.65,59.69 129.54,50.8 129.54,45.72 132.08,43.18 154.94,43.18 154.94,69.85 148.59,76.2 3.81,76.2 -2.54,69.85 -2.54,8.89
  cutout Top: 6.35,52.07 19.05,52.07 19.05,46.99 6.35,46.99
  cutout Top: 143.51,59.18 143.51,56.64 148.59,56.64 148.59,59.18
ALERT_1  (via drill 0.35)
  Top 0.203: R5.1 v120.65,19.05 | BRICK1.D 71.12,35.56 72.39,36.83 88.9,36.83 v90.17,38.1
  Bottom 0.203: BACKPLANE_LOGIC.11 125.48,2.29 114.55,2.29 114.3,2.54 114.3,10.16 116.33,12.19 118.36,12.19 120.65,14.48 v120.65,19.05 120.65,21.59 125.73,26.67 125.73,33.02 120.65,38.1 v90.17,38.1
ALERT_2  (via drill 0.35)
  Top 0.203: R6.1 v121.92,21.59
  Bottom 0.203: BACKPLANE_LOGIC.10 123.44,2.79 115.32,2.79 114.81,3.3 114.81,9.91 116.59,11.68 118.62,11.68 121.92,14.99 v121.92,21.59 127,26.67 127,33.02 120.65,39.37 88.9,39.37 87.63,38.1 87.63,35.56 BRICK2.D
C2_1
  Bottom 0.203: BACKPLANE_LOGIC.8 119.38,3.81 116.84,3.81 115.82,4.83 115.82,9.4 117.09,10.67 119.13,10.67 124.46,16 124.46,21.59 129.54,26.67 129.54,33.02 120.65,41.91 72.39,41.91 68.58,38.1 68.58,27.94 69.85,26.67 71.12,26.67 BRICK1.A
C2_2  (via drill 0.35)
  Top 0.203: v87.63,43.18 v82.55,38.1
  Bottom 0.203: BACKPLANE_LOGIC.7 116.33,6.86 116.33,9.14 117.35,10.16 119.38,10.16 125.73,16.51 125.73,21.59 130.81,26.67 130.81,33.02 120.65,43.18 v87.63,43.18 | v82.55,38.1 BRICK2.A
CLK  (via drill 0.35)
  Top 0.203: R7.1 v125.73,24.13
  Bottom 0.203: BACKPLANE_LOGIC.9 121.41,3.3 116.08,3.3 115.32,4.06 115.32,9.65 116.84,11.18 118.87,11.18 123.19,15.49 123.19,21.59 v125.73,24.13 128.27,26.67 128.27,33.02 120.65,40.64 87.63,40.64 86.36,39.37 | 86.36,39.37 86.36,36.83 BRICK2.C | 86.36,39.37 76.2,39.37 72.39,35.56 72.39,33.02 BRICK1.C
DATA  (via drill 0.35)
  Top 0.203: R4.1 v119.38,16.51
  Bottom 0.203: BACKPLANE_LOGIC.12 127.51,1.78 113.79,1.78 113.03,2.54 113.03,10.16 115.57,12.7 118.11,12.7 119.38,13.97 v119.38,16.51 119.38,21.59 124.46,26.67 124.46,33.02 120.65,36.83 93.98,36.83 83.82,26.67 81.28,26.67 BRICK2.E BRICK1.E
GND_RAW  (3 unrouted)
  pour Bottom: 39.37,64.77 39.37,76.2 40.64,77.47 77.47,77.47 78.74,76.2 78.74,69.85 76.2,67.31 72.39,67.31 68.58,63.5 40.64,63.5
LED_DRIVE_A  (2 unrouted)
LED_DRIVE_B
  Top 0.203: Q6.1 121.3,29.86 121.67,30.23 122.43,30.23 122.94,30.73 122.94,31.5 122.68,31.75 | R10.2 122.68,31.75 | 122.68,31.75 122.68,32.26 120.65,34.29 D7.A
N$1  (1 unrouted)
N$4  (1 unrouted)
N$5  (1 unrouted)
N$6
  Top 0.203: R11.2 118.11,21.59 120.65,24.13 Q6.3
N$7
  Top 0.203: R11.1 D8.C
ON/OFF  (3 unrouted)
  Top 0.203: BRICK2.B 80.01,33.02 77.47,33.02 74.93,30.48 72.39,30.48 BRICK1.B 68.58,29.21 67.31,30.48 67.31,39.37 78.74,50.8 100.33,50.8
ON/OFF_DRIVE  (2 unrouted)
OR_DRIVE_A  (4 unrouted)
OR_DRIVE_B  (via drill 0.35)
  Top 0.203: 113.03,34.29 113.54,33.78 113.54,32.51 112.52,31.5 110.24,31.5 109.22,30.48 109.22,29.21 | 113.03,34.29 Q4.1 | U4.5 110.49,27.94 109.22,29.21 | U2.6 103.56,28.27 104.09,27.73 105.08,27.73 U2.2 106.36,27.61 106.68,27.94 107.95,27.94 109.22,29.21 | D7.C 116.08,34.29 115.57,34.8 v115.57,35.56 | v113.03,35.56 113.03,34.29
  Bottom 0.203: v113.03,35.56 113.54,36.07 115.06,36.07 v115.57,35.56
REV_DRIVE  (2 unrouted)
VCAPH_A  (1 unrouted)
VCAPH_B
  Top 0.203: C2.1 111.76,26.67 112.27,26.16 112.27,25.65 111.76,25.15 98.55,25.15 97.79,25.91 97.79,27.18 98.23,27.61 U2.7
VCAPL_A  (1 unrouted)
VCAPL_B
  Top 0.203: U2.1 106.39,26.96 106.68,26.67 C2.2

### Text on the board
tValues: +48V | 48V_GND | 48V_ETHERNET | +12V_B | LM74610 | LM74610 | +12V | 12V_GND | +5V | 5V_ETHERNET | +12V_A
bValues: +48V | 48V_GND | +12V | 12V_GND | +5V